# EAGLE design N64 RGB AV Multiout Breakout PCB v1 (EAGLE 9.6.2)
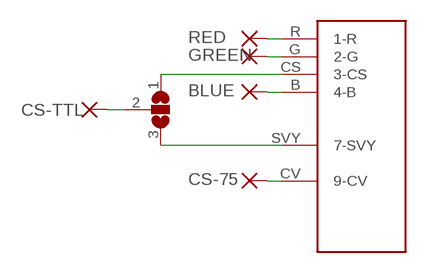
[diagram p0: schematic, sheet 1]

## Parts
BLUE  BLUE  PADSRECTANGLE-1,27X2,54  [RECTANGLE-1,27X2,54]
CS-75  CS-75  PADSRECTANGLE-1,27X2,54  [RECTANGLE-1,27X2,54]
CS-TTL  CS-TTL  PADSRECTANGLE-1,27X2,54  [RECTANGLE-1,27X2,54]
GREEN  GREEN  PADSRECTANGLE-1,27X2,54  [RECTANGLE-1,27X2,54]
N64-MULTIOUT  N64-MULTIOUT  [N64-MULTIOUT]
RED  RED  PADSRECTANGLE-1,27X2,54  [RECTANGLE-1,27X2,54]
SJ1  JUMPER-3JUMPER-3  [JUMPER-3]

## Nets
N$1: N64-MULTIOUT.R(1-R) RED.1(P)
N$2: GREEN.1(P) N64-MULTIOUT.G(2-G)
N$3: BLUE.1(P) N64-MULTIOUT.B(4-B)
N$4: CS-TTL.1(P) SJ1.2
N$5: N64-MULTIOUT.CS(3-CS) SJ1.1
N$6: N64-MULTIOUT.SVY(7-SVY) SJ1.3
N$7: CS-75.1(P) N64-MULTIOUT.CV(9-CV)

## Library data of the parts
BLUE CS-75 CS-TTL GREEN RED = Consoles Unleashed Eagle Parts Library:PADS: PADS to connect wires to PCB
N64-MULTIOUT = Consoles Unleashed Eagle Parts Library:N64-MULTIOUT
SJ1 = Consoles Unleashed Eagle Parts Library:JUMPER-3: Jumper Pads x 3

## Board
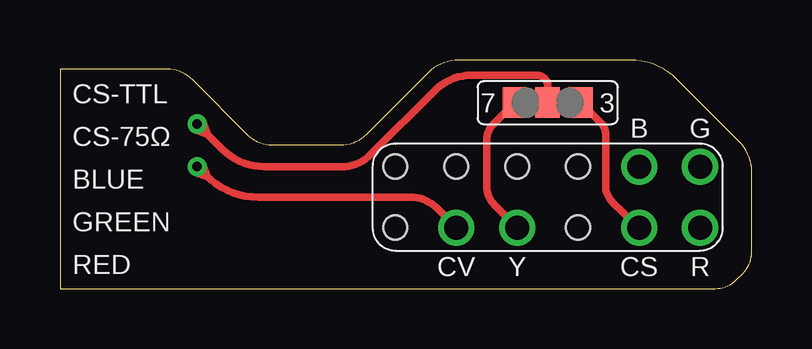
[diagram p1: board, top side]
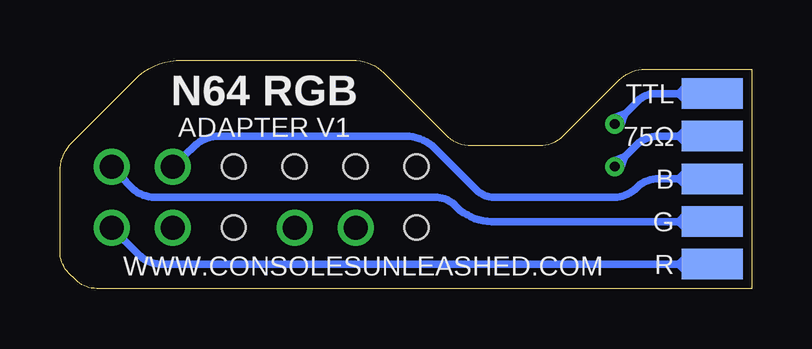
[diagram p2: board, bottom side, seen from below]

Size 28.83 x 9.53 mm. Coordinates in mm from the lower left corner, seen from the top.
Outline: 0,0 27.3,0 arc45 28.17,0.36 28.46,0.65 arc45 28.83,1.54 28.83,4.87 arc45 28.32,6.1 25.7,8.72 arc45 23.75,9.53 16.64,9.53 arc45 15.34,8.99 12.76,6.41 arc-45 11.7,5.97 8.83,5.97 arc-45 7.85,6.37 5.52,8.7 arc45 4.45,9.14 0,9.14 0,0
Copper layers (1*16): Top 0.035559375mm / dielectric 1.6mm / Bottom 0.035559375mm
Design rules "oshpark-2layer *": minimum track width 6mil, minimum drill 10mil, track to track 6mil, track to pad 6mil, pad to pad 6mil, via to via 6mil, smd to smd 6mil, copper to edge 15mil, drill to drill 6mil, minimum pad ring 5mil, minimum via ring 5mil, stop-mask expansion 2.5mil, vias tented up to drill 1mm, thermal gap 12mil

### Footprints (pad centres in the part's own frame; a part is rotated, then mirrored left to right if it is on the bottom)
RECTANGLE-1,27X2,54 = smd 1.27 x 2.54: 1 0,0
N64-MULTIOUT = drill 1 pad 1.51: B 3.81,1.27; CS 3.81,-1.27; CV -3.81,-1.27; G 6.35,1.27; R 6.35,-1.27; SVY -1.27,-1.27 | hole 1: -6.35,-1.27; -6.35,1.27; -1.27,1.27; -3.81,1.27; 1.27,-1.27; 1.27,1.27
JUMPER-3 = smd 1.016 x 1.27: 1 -1.372,0; 2 0,0; 3 1.372,0

### Placement (x,y rotation side)
BLUE  1.65,4.57 90 bottom
CS-75  1.65,6.35 90 bottom
CS-TTL  1.65,8.13 90 bottom
GREEN  1.65,2.79 90 bottom
N64-MULTIOUT  20.32,3.81 0 top
RED  1.65,1.02 90 bottom
SJ1  20.32,7.75 180 top

### Tracks (layer width: path | path; a pad name or v marks a point on that pad's centre or on a via)
N$1
  Bottom 0.305: RED.1 24.56,1.02 arc45 25.56,1.43 N64-MULTIOUT.R | 3.05,1.02 2.73,1.33 2.73,0.7 3.05,1.02
N$2
  Bottom 0.305: N64-MULTIOUT.G 25.87,4.23 arc-47 24.89,3.81 13.21,3.81 arc45 12.36,3.45 12.29,3.39 arc-45 10.85,2.79 GREEN.1 | 3.05,2.79 2.73,3.11 2.73,2.48 3.05,2.79
N$3
  Bottom 0.305: N64-MULTIOUT.B 23.19,5.97 arc43 22.23,6.35 14.43,6.35 arc45 13.21,5.85 11.47,4.1 arc-45 10.76,3.81 5.71,3.81 arc-45 4.85,4.17 arc45 3.88,4.57 BLUE.1 | 3.05,4.57 2.73,4.89 2.73,4.25 3.05,4.57
N$4  (via drill 0.4 pad 0.8)
  Top 0.305: v5.71,6.86 6.76,5.81 arc45 8.53,5.08 11.73,5.08 arc45 12.95,5.59 15.63,8.26 arc-45 17.14,8.89 19.88,8.89 arc-45 20.19,8.76 arc-45 20.32,8.45 SJ1.2 | v5.71,6.86 5.95,6.95 6.14,6.43 5.63,6.63 v5.71,6.86
  Bottom 0.305: CS-TTL.1 3.05,8.13 | 3.05,8.13 4,8.13 arc-45 4.76,7.82 v5.71,6.86 | v5.71,6.86 5.48,6.77 5.29,7.28 5.8,7.09 v5.71,6.86 | 3.05,8.13 2.73,8.45 2.73,7.81 3.05,8.13
N$5
  Top 0.305: SJ1.1 22.53,6.91 arc-45 22.73,6.41 22.73,4.3 arc47 23.05,3.56 N64-MULTIOUT.CS
N$6
  Top 0.305: SJ1.3 18.04,6.84 arc45 17.78,6.21 17.78,4.25 arc45 18.09,3.5 N64-MULTIOUT.SVY
N$7  (via drill 0.4 pad 0.8)
  Top 0.305: N64-MULTIOUT.CV 15.69,3.36 arc45 14.61,3.81 8.26,3.81 arc-45 6.09,4.71 v5.71,5.08 | v5.71,5.08 5.95,5.17 6.14,4.66 5.63,4.85 v5.71,5.08
  Bottom 0.305: CS-75.1 3.92,6.35 arc-45 4.81,5.98 v5.71,5.08 | v5.71,5.08 5.48,4.99 5.29,5.5 5.8,5.31 v5.71,5.08 | 3.05,6.35 2.73,6.67 2.73,6.03 3.05,6.35

### Text on the board
tNames: CS-TTL | 7 | 3 | CS-75Ω | B | G | BLUE | GREEN | RED | CV | Y | CS | R
bNames: TTL | N64 RGB | ADAPTER V1 | 75Ω | B | G | R | WWW.CONSOLESUNLEASHED.COM